# Altium schematic sheet power.SchDoc
size A2
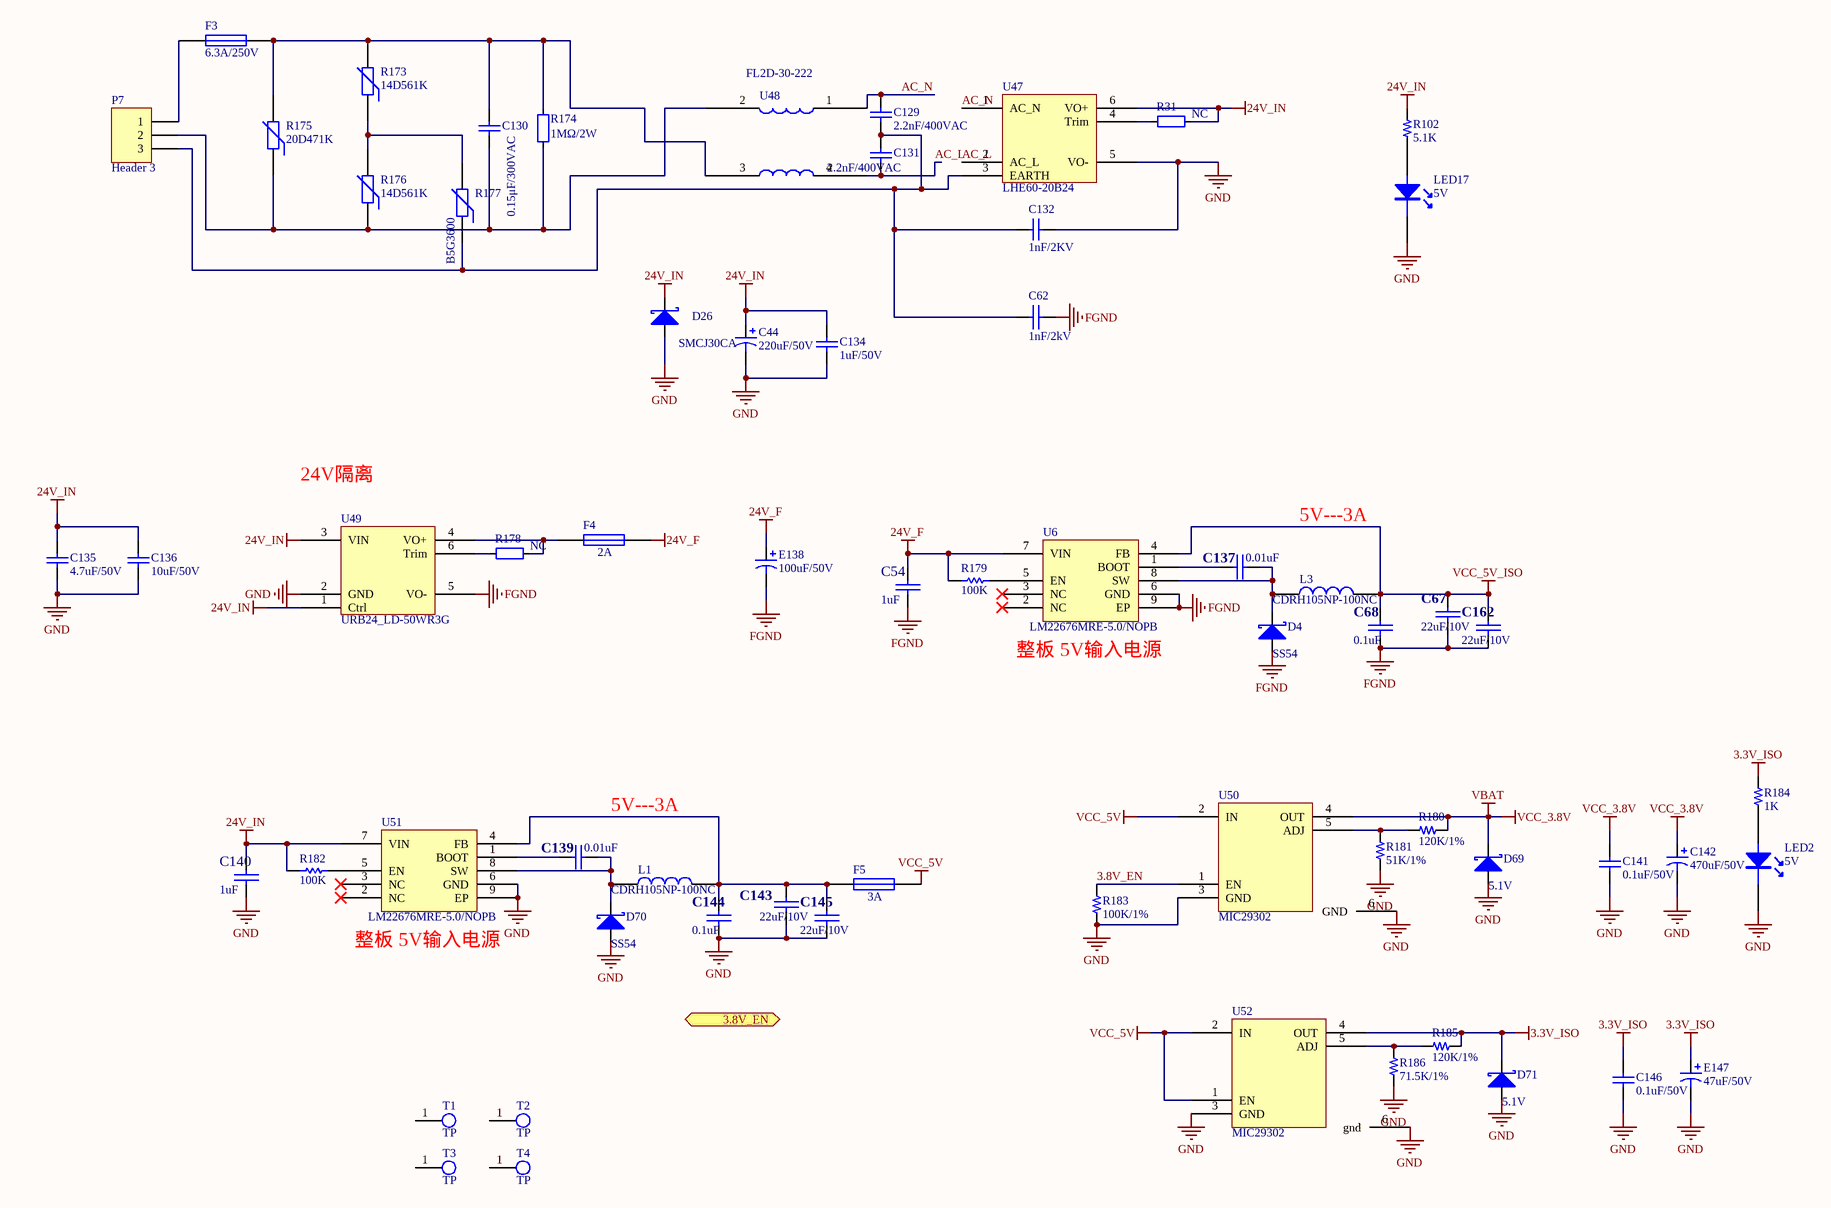
[diagram p0: power.SchDoc]

## Parts
C44  220uF/50V  [Φ10×10]
C54  1uF  [0603C]
C62  1nF/2kV  [1206C]
C67  22uF/10V  [1210C]
C68  0.1uF  [0603C]
C129  2.2nF/400VAC  [15x18]
C130  0.15μF/300VAC  [15x18]
C131  2.2nF/400VAC  [15x18]
C132  1nF/2KV  [1206C]
C134  1uF/50V  [1210C]
C135  4.7uF/50V  [1210C]
C136  10uF/50V  [1210C]
C137  0.01uF  [0603C]
C139  0.01uF  [0603C]
C140  1uF  [0603C]
C141  0.1uF/50V  [0603C]
C142  470uF/50V  [Φ10×10]
C143  22uF/10V  [1210C]
C144  0.1uF  [0603C]
C145  22uF/10V  [1210C]
C146  0.1uF/50V  [0603C]
C162  22uF/10V  [1210C]
D4  SS54  [SMC]
D26  SMCJ30CA  [SMC]
D69  5.1V  [SMA]
D70  SS54  [SMC]
D71  5.1V  [SMA]
E138  100uF/50V  [Φ10×10]
E147  47uF/50V  [Φ10×10]
F3  6.3A/250V  [可视开关电源保险丝座]
F4  2A  [1812-F]
F5  3A  [1812-F]
L1  CDRH105NP-100NC  [CDRH105]
L3  CDRH105NP-100NC  [CDRH105]
LED2  5V  [0603LED]
LED17  5V  [0603LED]
P7  Header 3  [KF128V-3P]
R31  NC  [0603r]
R102  5.1K  [0603R]
R173  14D561K  [14D561K]
R174  1MΩ/2W  [5x15.5]
R175  20D471K  [20D471K]
R176  14D561K  [14D561K]
R177  B5G3600  [B5G3600]
R178  NC  [0603r]
R179  100K  [0603R]
R180  120K/1%  [0603R]
R181  51K/1%  [0603R]
R182  100K  [0603R]
R183  100K/1%  [0603R]
R184  1K  [0603R]
R185  120K/1%  [0603R]
R186  71.5K/1%  [0603R]
T1  TP  [m2.5]
T2  TP  [m2.5]
T3  TP  [m2.5]
T4  TP  [m2.5]
U6  LM22676MRE-5.0/NOPB  [SOP127P600X168_HS-8N]
U47  LHE60-20B24  [LHE60-20B24]
U48  FL2D-30-222  [TY-100P]
U49  URB24_LD-50WR3G  [URB24_LD-50WR3G]
U50  MIC29302  [TO228P1435X457-6N]
U51  LM22676MRE-5.0/NOPB  [SOP127P600X168_HS-8N]
U52  MIC29302  [TO228P1435X457-6N]

## Ports
3.8V_EN (in)

## Nets
3.3V_ISO: C146.2 D71.2(K) E147.1 R184.2 R185.1 U52.4(OUT)
24V_F: C54.2 E138.1 F4.2 R179.2 U6.7(VIN)
24V_IN: C44.1 C134.2 C135.2 C136.2 C140.2 D26.2(K) R31.2 R102.2 R182.2 U47.6(VO+) U49.1(Ctrl) U49.3(VIN) U51.7(VIN)
FGND: C54.1 C62.1 C67.2 C68.2 C162.2 D4.1(A) E138.2 U6.6(GND) U6.9(EP) U49.5(VO-)
GND: C44.2 C132.1 C134.1 C135.1 C136.1 C140.1 C141.1 C142.2 C143.2 C144.2 C145.2 C146.1 D26.1(A) D69.1(A) D70.1(A) D71.1(A) E147.2 LED2.2 LED17.2 R181.1 R183.1 R186.1 U47.5(VO-) U49.2(GND) U50.3(GND) U50.6(GND) U51.6(GND) U51.9(EP) U52.3(GND) U52.6(gnd)
VBAT: C141.2 C142.1 D69.2(K) R180.1 U50.4(OUT)  [also labelled VCC_3.8V]
VCC_5V: F5.2 U50.2(IN) U52.1(EN) U52.2(IN)
VCC_5V_ISO: C67.1 C68.1 C162.1 L3.2 U6.4(FB)
3.8V_EN: R183.2 U50.1(EN)
AC_L: C131.1 U47.2(AC_L) U48.4
AC_N: C129.2 U47.1(AC_N) U48.1(L)
NetC62_2: C62.2 C129.1 C131.2 C132.2 P7.3 R177.1 U47.3(EARTH)
NetC130_1: C130.1 P7.2 R174.2 R175.1 R176.1 U48.2(L)
NetC130_2: C130.2 F3.2 R173.2 R174.1 R175.2 U48.3(L)
NetC137_1: C137.1 D4.2(K) L3.1 U6.8(SW)
NetC137_2: C137.2 U6.1(BOOT)
NetC139_1: C139.1 D70.2(K) L1.1 U51.8(SW)
NetC139_2: C139.2 U51.1(BOOT)
NetC143_1: C143.1 C144.1 C145.1 F5.1 L1.2 U51.4(FB)
NetF3_1: F3.1 P7.1
NetF4_1: F4.1 R178.2 U49.4(VO+)
NetLED2_1: LED2.1 R184.1
NetLED17_1: LED17.1 R102.1
NetR31_1: R31.1 U47.4(Trim)
NetR173_1: R173.1 R176.2 R177.2
NetR178_1: R178.1 U49.6(Trim)
NetR179_1: R179.1 U6.5(EN)
NetR180_2: R180.2 R181.2 U50.5(ADJ)
NetR182_1: R182.1 U51.5(EN)
NetR185_2: R185.2 R186.2 U52.5(ADJ)

Not connected (* = marked no-connect by the designer): T1 1; T2 1; T3 1; T4 1; U6 2(NC)* 3(NC)*; U51 2(NC)* 3(NC)*

## Notes on the sheet
- 24V隔离
- 5V---3A
- (near U6) 整板 5V输入电源
- (near U51) 整板 5V输入电源

## Library data of the parts
C44 = Cap Pol1: Polarized Capacitor (Radial); Published: 8-Jun-2000; LatestRevisionDate: 17-Jul-2002; LatestRevisionNote: Re-released for DXP Platform.; PackageReference: RB7.6-15; Publisher: Altium Limited; Value: 220uF/50V
C54 C62 C67 C68 C137 C139 C140 C143-C145 C162 = CAP: Capacitor
C129-C132 C134-C136 C141 C146 = Cap: Capacitor; Value: 22nF; Published: 8-Jun-2000; LatestRevisionDate: 17-Jul-2002; LatestRevisionNote: Re-released for DXP Platform.; PackageReference: RAD-0.3; Publisher: Altium Limited; PackageDescription: Radial Cap, Thru-Hole; 2 Leads; 0.3 in Pin Spacing
C142 E138 E147 = Cap Pol1: Polarized Capacitor (Radial); Value: 100pF; Published: 8-Jun-2000; LatestRevisionDate: 17-Jul-2002; LatestRevisionNote: Re-released for DXP Platform.; PackageReference: RB7.6-15; Publisher: Altium Limited
D4 D26 D69-D71 = DIODE S: Schottky Diode
F3-F5 = Fuse 1: Fuse; Published: 8-Jun-2000; LatestRevisionDate: 17-Jul-2002; LatestRevisionNote: Re-released for DXP Platform.; PackageReference: PIN-W2/E2.8; Publisher: Altium Limited; PackageDescription: Thru-Hole; 2 Leads
L1 L3 = INDUCTOR
LED2 LED17 = LED
P7 = Header 3: Header, 3-Pin; LatestRevisionDate: 17-Jul-2002; LatestRevisionNote: Re-released for DXP Platform.; Publisher: Altium Limited
R31 R174 R178 = RES0603: 物料主编码(PN): 150000040; Value: 100K; ID: 233; 序号: 109; 物料名称: 贴片电阻; 精度: ±1%; 规格型号(完整型号): RC1608F103CS/RC0603FR-0710KL; 物料描述: RES,贴片电阻,0603,10k,±1%,1/10W,1.6X0.8X0.45mm,RC1608F103CS/RC0603FR-0710KL; 工作温度: –55°C to 155°C; 制造商: 三星/YAGEO; 器件等级: ——; 物料类型: 表贴电阻; 参数值: 1.00E+04
R102 R180 R181 R183-R186 = R
R173 R175-R177 = Res Varistor: Varistor (Voltage-Sensitive Resistor); Published: 24-Mar-1999; LatestRevisionDate: 29-May-2009; LatestRevisionNote: IPC-7351 Footprint Added.; PackageVersion: Mar-2003; PackageReference: 6-0805; Publisher: Altium Limited; PackageDescription: Chip Resistor 0805 Case Size; Code_IPC: RESC2012
R179 R182 = Res1: Resistor; Published: 8-Jun-2000; LatestRevisionDate: 17-Jul-2002; LatestRevisionNote: Re-released for DXP Platform.; PackageReference: AXIAL-0.3; Publisher: Altium Limited
U6 U51 = LM22676MR-5.0
U48 = TY-100P: PCB mounting filters